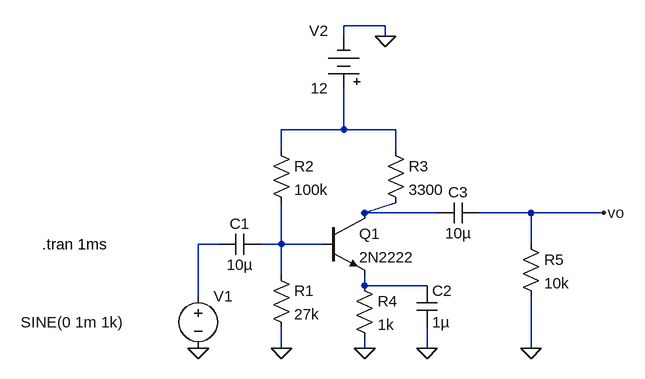
[diagram p0: schematic Draft8.asc]
Draft8.asc, the LTspice schematic file:
Version 4
SHEET 1 880 680
WIRE 208 -128 144 -128
WIRE 144 -112 144 -128
WIRE 208 -112 208 -128
WIRE 144 32 144 -32
WIRE 144 32 48 32
WIRE 224 32 144 32
WIRE 48 64 48 32
WIRE 224 64 224 32
WIRE 176 160 224 144
WIRE 288 160 176 160
WIRE 432 160 352 160
WIRE 544 160 432 160
WIRE -48 208 -80 208
WIRE 48 208 48 144
WIRE 48 208 16 208
WIRE 112 208 48 208
WIRE 432 208 432 160
WIRE 48 256 48 208
WIRE 176 272 176 256
WIRE 272 272 176 272
WIRE -80 288 -80 208
WIRE 48 368 48 336
WIRE 176 368 176 352
WIRE 272 368 272 336
WIRE 432 368 432 288
FLAG -80 368 0
FLAG 48 368 0
FLAG 176 368 0
FLAG 272 368 0
FLAG 432 368 0
FLAG 544 160 vo
FLAG 208 -112 0
SYMBOL voltage -80 272 R0
WINDOW 3 -273 56 Left 2
WINDOW 123 0 0 Left 0
WINDOW 39 0 0 Left 0
SYMATTR InstName V1
SYMATTR Value SINE(0 1m 1k)
SYMBOL cap 16 192 R90
WINDOW 0 0 32 VBottom 2
WINDOW 3 32 32 VTop 2
SYMATTR InstName C1
SYMATTR Value 10µ
SYMBOL res 32 240 R0
SYMATTR InstName R1
SYMATTR Value 27k
SYMBOL res 32 48 R0
SYMATTR InstName R2
SYMATTR Value 100k
SYMBOL res 208 48 R0
SYMATTR InstName R3
SYMATTR Value 3300
SYMBOL npn 112 160 R0
SYMATTR InstName Q1
SYMATTR Value 2N2222
SYMBOL res 160 256 R0
SYMATTR InstName R4
SYMATTR Value 1k
SYMBOL cap 256 272 R0
SYMATTR InstName C2
SYMATTR Value 1µ
SYMBOL cap 352 144 R90
WINDOW 0 0 32 VBottom 2
WINDOW 3 32 32 VTop 2
SYMATTR InstName C3
SYMATTR Value 10µ
SYMBOL res 416 192 R0
SYMATTR InstName R5
SYMATTR Value 10k
SYMBOL Misc\\battery 144 -16 R180
WINDOW 0 24 104 Left 2
WINDOW 3 24 16 Left 2
WINDOW 123 0 0 Left 0
WINDOW 39 0 0 Left 0
SYMATTR InstName V2
SYMATTR Value 12
TEXT -320 208 Left 2 !.tran 1ms

The netlist it stands for:
* Draft8.asc
V1 N003 0 SINE(0 1m 1k)
C1 N004 N003 10µ
R1 N004 0 27k
R2 N001 N004 100k
R3 N001 N002 3300
Q1 N002 N004 N005 0 2N2222
R4 N005 0 1k
C2 N005 0 1µ
C3 vo N002 10µ
R5 vo 0 10k
V2 N001 0 12
.model NPN NPN
.model PNP PNP
.lib standard.bjt
.tran 1ms
.backanno
.end